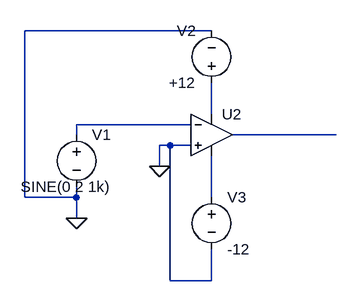
[diagram p0: schematic inverting openloop.asc]
inverting openloop.asc, the LTspice schematic file:
Version 4
SHEET 1 880 680
WIRE 176 16 -112 16
WIRE 176 144 176 96
WIRE 144 160 -32 160
WIRE -32 176 -32 160
WIRE 368 176 208 176
WIRE 112 192 96 192
WIRE 144 192 112 192
WIRE 96 224 96 192
WIRE -112 272 -112 16
WIRE -32 272 -32 256
WIRE -32 272 -112 272
WIRE 176 272 176 208
WIRE -32 304 -32 272
WIRE 112 400 112 192
WIRE 176 400 176 352
WIRE 176 400 112 400
FLAG 96 224 0
FLAG -32 304 0
SYMBOL Opamps\\UniversalOpamp2 176 176 R0
SYMATTR InstName U2
SYMBOL voltage -32 160 R0
WINDOW 3 -86 96 Left 2
WINDOW 123 0 0 Left 0
WINDOW 39 0 0 Left 0
SYMATTR InstName V1
SYMATTR Value SINE(0 2 1k)
SYMBOL voltage 176 112 R180
WINDOW 0 24 96 Left 2
WINDOW 3 24 16 Left 2
WINDOW 123 0 0 Left 0
WINDOW 39 0 0 Left 0
SYMATTR InstName V2
SYMATTR Value +12
SYMBOL voltage 176 256 R0
WINDOW 123 0 0 Left 0
WINDOW 39 0 0 Left 0
SYMATTR InstName V3
SYMATTR Value -12

The netlist it stands for:
* inverting openloop.asc
XU2 0 N002 N001 N004 N003 level.2 Avol=1Meg GBW=10Meg Slew=10Meg ilimit=25m rail=0 Vos=0 phimargin=45 en=0 enk=0 in=0 ink=0 Rin=500Meg  ; pins IN+ IN- V+ V- OUT
V1 N002 0 SINE(0 2 1k)
V2 N001 0 +12
V3 N004 0 -12
.lib UniversalOpamps2.sub
.backanno
.end